# EAGLE design untitled (EAGLE 9.3.1)
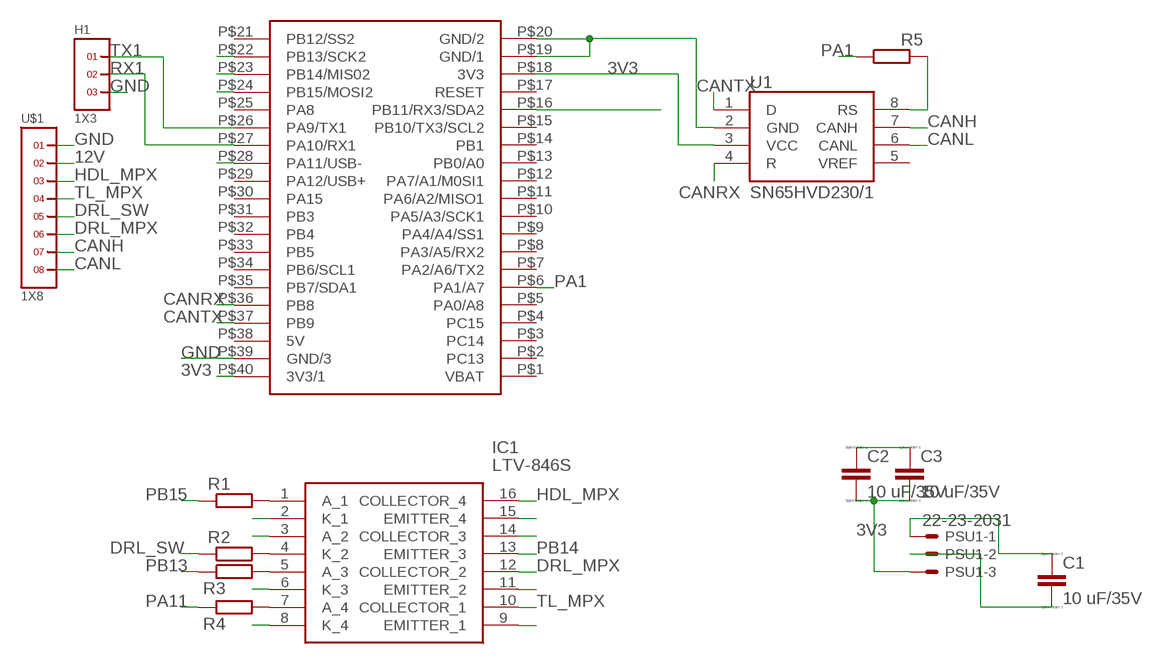
[diagram p0: schematic, sheet 1]

## Parts
C1  10 uF/35V  CC1206  [C1206]
C2  10 uF/35V  CC1206  [C1206]
C3  10 uF/35V  CC1206  [C1206]
H1  1X3  [1X3]
IC1  LTV-846S  [SOP254P1016X460-16N]
PSU1  22-23-2031  [22-23-2031]
R1  47 ohm  R-EU_R1206  [R1206]
R2  1k ohm  R-EU_R1206  [R1206]
R3  47 ohm  R-EU_R1206  [R1206]
R4  47 ohm  R-EU_R1206  [R1206]
R5  47k ohm  R-EU_R1206  [R1206]
STM32  BLUEPILL  [40-DIP-BLUE-PIL]
U1  SN65HVD230/1  [SO8]
U$1  1X8  [1X8]

## Nets
3V3: C2.2 C3.2 IC1.3(A_2) IC1.14(COLLECTOR_3) PSU1.3 STM32.P$18(3V3) STM32.P$40(3V3/1) U1.3(VCC)
12V: C1.1 PSU1.1 U$1.2
CANH: U1.7(CANH) U$1.7
CANL: U1.6(CANL) U$1.8
CANRX: STM32.P$36(PB8) U1.4(R)
CANTX: STM32.P$37(PB9) U1.1(D)
DRL_MPX: IC1.12(COLLECTOR_2) U$1.6
DRL_SW: R2.1 U$1.5
GND: C1.2 C2.1 C3.1 H1.3 IC1.2(K_1) IC1.6(K_3) IC1.8(K_4) IC1.9(EMITTER_1) IC1.11(EMITTER_2) IC1.15(EMITTER_4) PSU1.2 STM32.P$19(GND/1) STM32.P$20(GND/2) STM32.P$39(GND/3) U1.2(GND) U$1.1
HDL_MPX: IC1.16(COLLECTOR_4) U$1.3
N$2: IC1.1(A_1) R1.2
N$4: IC1.4(K_2) R2.2
N$6: IC1.5(A_3) R3.2
N$8: IC1.7(A_4) R4.2
N$9: R5.2 U1.8(RS)
PA1: R5.1 STM32.P$6(PA1/A7)
PA11: R4.1 STM32.P$28(PA11/USB-)
PB11: STM32.P$16(PB11/RX3/SDA2)
PB13: R3.1 STM32.P$22(PB13/SCK2)
PB14: IC1.13(EMITTER_3) STM32.P$23(PB14/MIS02)
PB15: R1.1 STM32.P$24(PB15/MOSI2)
RX1: H1.2 STM32.P$27(PA10/RX1)
TL_MPX: IC1.10(COLLECTOR_1) U$1.4
TX1: H1.1 STM32.P$26(PA9/TX1)
Unconnected: STM32.P$1(VBAT) STM32.P$2(PC13) STM32.P$3(PC14) STM32.P$4(PC15) STM32.P$5(PA0/A8) STM32.P$7(PA2/A6/TX2) STM32.P$8(PA3/A5/RX2) STM32.P$9(PA4/A4/SS1) STM32.P$10(PA5/A3/SCK1) STM32.P$11(PA6/A2/MISO1) STM32.P$12(PA7/A1/M0SI1) STM32.P$13(PB0/A0) STM32.P$14(PB1) STM32.P$15(PB10/TX3/SCL2) STM32.P$17(RESET) STM32.P$21(PB12/SS2) STM32.P$25(PA8) STM32.P$29(PA12/USB+) STM32.P$30(PA15) STM32.P$31(PB3) STM32.P$32(PB4) STM32.P$33(PB5) STM32.P$34(PB6/SCL1) STM32.P$35(PB7/SDA1) STM32.P$38(5V) U1.5(VREF)

## Library data of the parts
C1-C3 = eagle-ltspice:C: CAPACITOR, European symbol; SPICEMODEL: NONE; SPICEPREFIX: C
H1 = headers(.1in):1X3
IC1 = LTV-846S:LTV-846S: Optocoupler Transistor O/P, 80V, SMD16 Lite-On LTV-846S DC Input Transistor Output Quad Optocoupler, Surface Mount, 16-Pin PDIP Source: Datasheet <http://optoelectronics.liteon.com/upload/download/DS-70-97-0013/S_110_LTV-816 826 846 (M, S, S-TA, S-TA1, S-TP) Series.pdf>; ALLIED_NUMBER: R1038113; ALLIED_PRICE-STOCK: http://www.alliedelec.com/lite-on-ltv-846s/R1038113/; DESCRIPTION: Optocoupler Transistor O/P, 80V, SMD16 Lite-On LTV-846S DC Input Transistor Output Quad Optocoupler, Surface Mount, 16-Pin PDIP; HEIGHT: 4.6mm; MANUFACTURER_NAME: Lite-On; MANUFACTURER_PART_NUMBER: LTV-846S; MOUSER_PART_NUMBER: 859-LTV-846S; MOUSER_PRICE-STOCK: https://www.mouser.com/Search/Refine.aspx?Keyword=859-LTV-846S; RS_PART_NUMBER: 1689678; RS_PRICE-STOCK: http://uk.rs-online.com/web/p/products/1689678
PSU1 = con-molex:22-23-2031: .100" (2.54mm) Center Header - 3 Pin; MF: MOLEX; MPN: 22-23-2031; OC_FARNELL: 1462950; OC_NEWARK: 30C0862
R1-R5 = rcl:R-EU_: RESISTOR, European symbol; SPICEPREFIX: R
STM32 = maplemini:BLUEPILL
U1 = texas_instruments:SN65HVD230/1
U$1 = headers(2mm):1X8

## Board
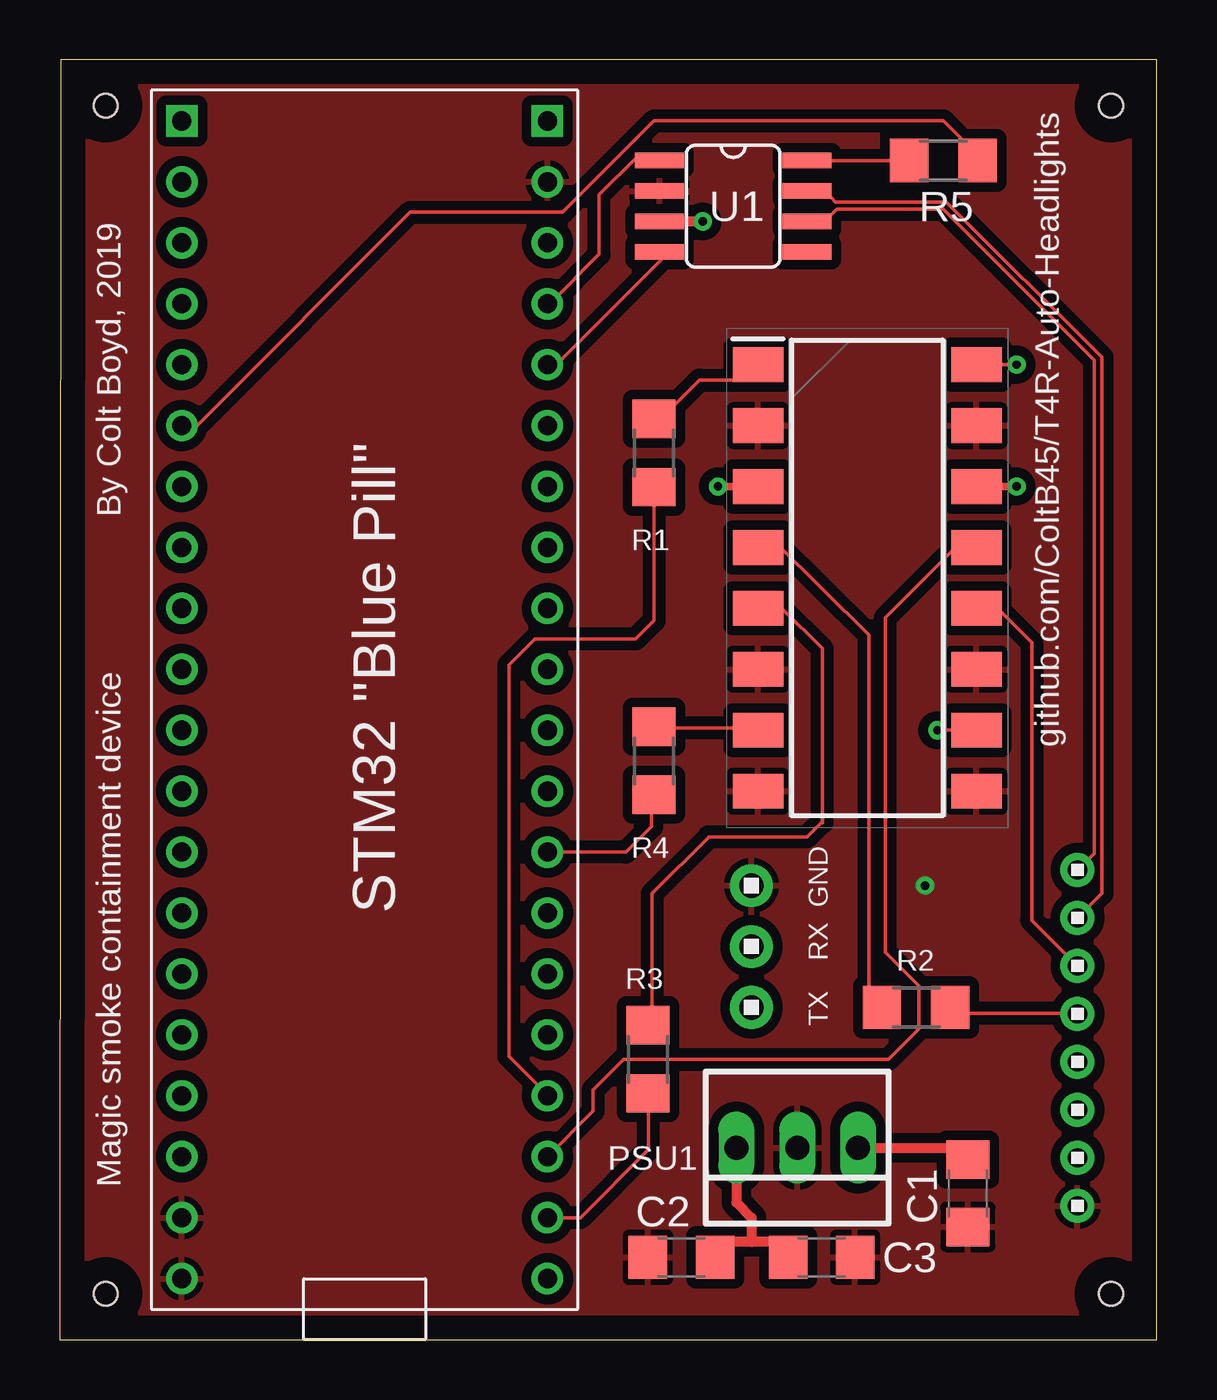
[diagram p1: board, top side]
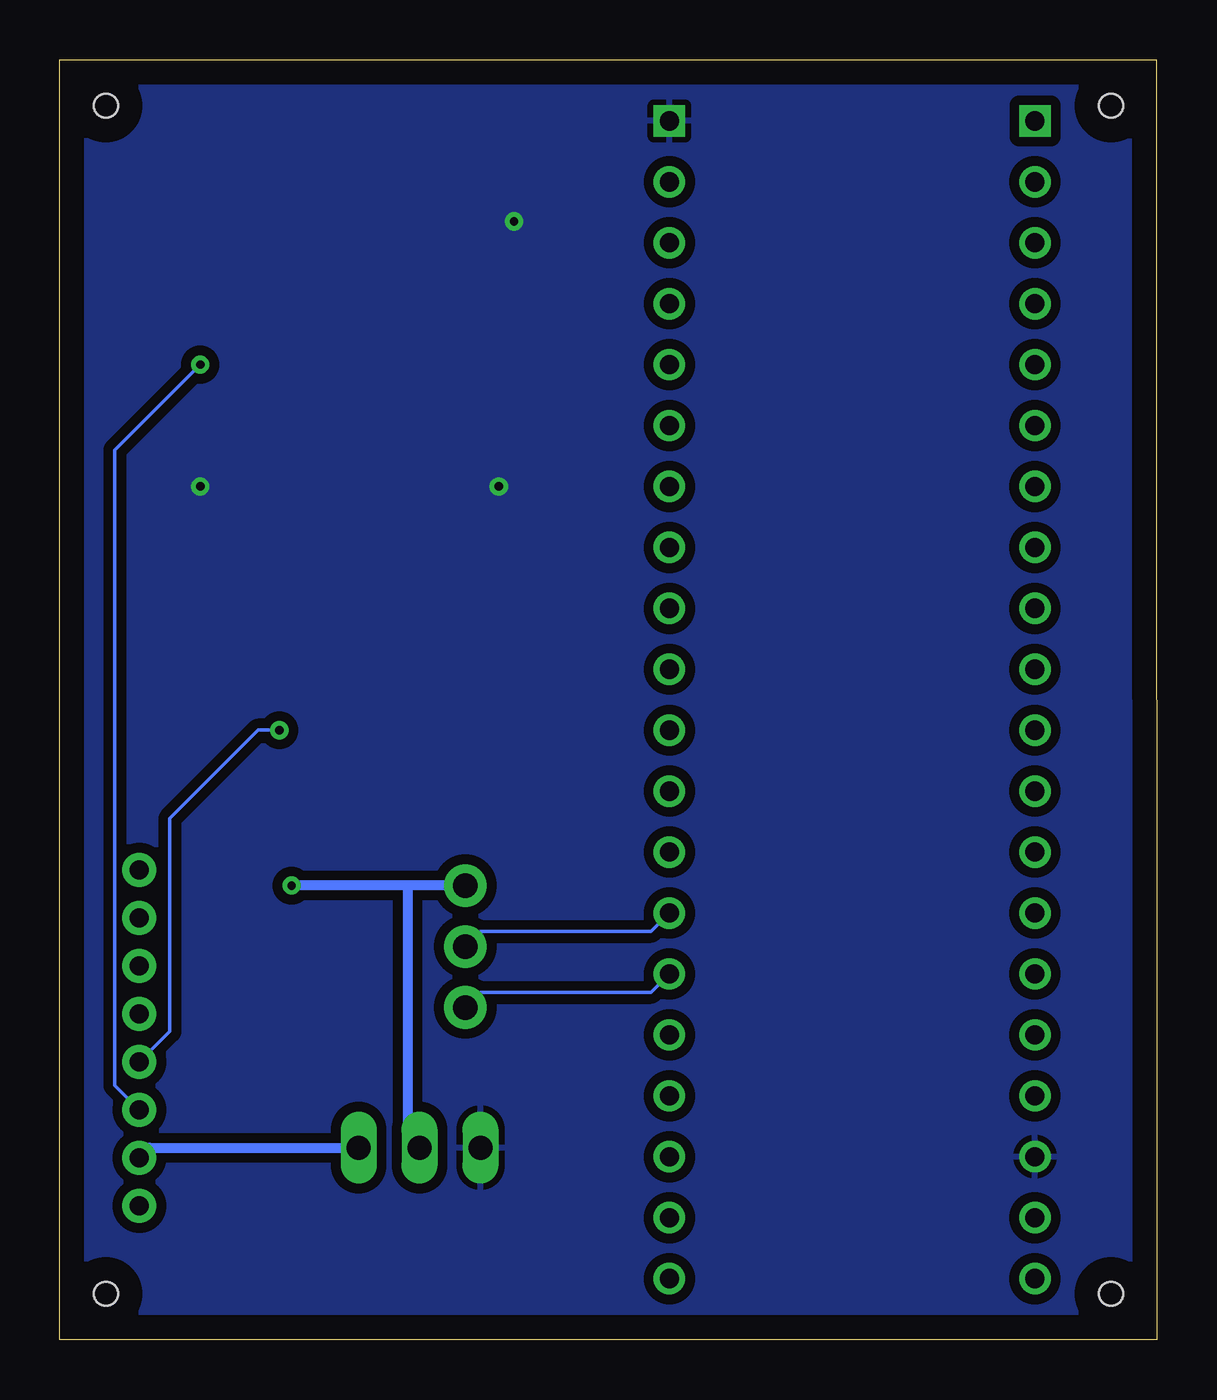
[diagram p2: board, bottom side, seen from below]

Size 45.73 x 53.34 mm. Coordinates in mm from the lower left corner, seen from the top.
Outline: 0,0 45.73,0 45.73,53.34 0.03,53.34 0,0
Copper layers (1*16): Top 0.035mm / dielectric 1.5mm / Bottom 0.035mm
Design rules "default": minimum track width 6mil, minimum drill 0.35mm, track to track 6mil, track to pad 6mil, pad to pad 6mil, via to via 6mil, smd to smd 6mil, copper to edge 40mil, drill to drill 6mil, minimum pad ring 10mil, minimum via ring 8mil, stop-mask expansion 4mil, vias tented up to drill 0mil, thermal gap 10mil
Holes 1 mm at 1.91,1.91 43.81,1.91 1.91,51.44 43.81,51.44

### Footprints (pad centres in the part's own frame; a part is rotated, then mirrored left to right if it is on the bottom)
C1206 = smd 1.6 x 1.8: 1 -1.4,0; 2 1.4,0
1X3 = drill 1.016 pad 1.778: 1 0,0; 2 2.54,0; 3 5.08,0
SOP254P1016X460-16N = smd 2.1 x 1.45: 1 -4.55,8.89; 2 -4.55,6.35; 3 -4.55,3.81; 4 -4.55,1.27; 5 -4.55,-1.27; 6 -4.55,-3.81; 7 -4.55,-6.35; 8 -4.55,-8.89; 9 4.55,-8.89; 10 4.55,-6.35; 11 4.55,-3.81; 12 4.55,-1.27; 13 4.55,1.27; 14 4.55,3.81; 15 4.55,6.35; 16 4.55,8.89
22-23-2031 = drill 1 long: 1 -2.54,0; 2 0,0; 3 2.54,0
R1206 = smd 1.6 x 1.803: 1 -1.422,0; 2 1.422,0
40-DIP-BLUE-PIL = drill 0.8 square: P$1 -7.62,22.86; P$40 7.62,22.86 | drill 0.8: P$2 -7.62,20.32; P$3 -7.62,17.78; P$4 -7.62,15.24; P$5 -7.62,12.7; P$6 -7.62,10.16; P$7 -7.62,7.62; P$8 -7.62,5.08; P$9 -7.62,2.54; P$10 -7.62,0; P$11 -7.62,-2.54; P$12 -7.62,-5.08; P$13 -7.62,-7.62; P$14 -7.62,-10.16; P$15 -7.62,-12.7; P$16 -7.62,-15.24; P$17 -7.62,-17.78; P$18 -7.62,-20.32; P$19 -7.62,-22.86; P$20 -7.62,-25.4; P$21 7.62,-25.4; P$22 7.62,-22.86; P$23 7.62,-20.32; P$24 7.62,-17.78; P$25 7.62,-15.24; P$26 7.62,-12.7; P$27 7.62,-10.16; P$28 7.62,-7.62; P$29 7.62,-5.08; P$30 7.62,-2.54; P$31 7.62,0; P$32 7.62,2.54; P$33 7.62,5.08; P$34 7.62,7.62; P$35 7.62,10.16; P$36 7.62,12.7; P$37 7.62,15.24; P$38 7.62,17.78; P$39 7.62,20.32
SO8 = smd 0.66 x 2.032: 1 -1.905,-3.073; 2 -0.635,-3.073; 3 0.635,-3.073; 4 1.905,-3.073; 5 1.905,3.073; 6 0.635,3.073; 7 -0.635,3.073; 8 -1.905,3.073
1X8 = drill 0.8 pad 1.422: 1 -7,0; 2 -5,0; 3 -3,0; 4 -1,0; 5 1,0; 6 3,0; 7 5,0; 8 7,0

### Placement (x,y rotation side)
C1  37.85,6.1 270 top
C2  25.91,3.43 0 top
C3  31.75,3.43 180 top
H1  28.83,13.84 90 top
IC1  33.66,31.75 0 top
PSU1  30.73,8 180 top
R1  24.77,36.96 90 top
R2  35.69,13.84 180 top
R3  24.51,11.68 90 top
R4  24.77,24.13 90 top
R5  36.83,49.15 180 top
STM32  12.7,27.94 0 top
U1  28.07,47.24 270 top
U$1  42.42,12.57 90 top

### Tracks (layer width: path | path; a pad name or v marks a point on that pad's centre or on a via)
3V3  (via drill 0.35)
  Top 0.305: v27.43,35.56 IC1.3 | v39.88,35.56 IC1.14
  Top 0.406: PSU1.3 28.19,5.72 28.83,5.08 28.83,4.06 | 28.83,4.06 27.94,4.06 C2.2 | C3.2 29.71,4.06 28.83,4.06 | v26.8,46.61 U1.3
  pour Bottom (isolate 0.406): 0.13,53.21 45.59,53.21 45.59,0.13 0.13,0.13
12V
  Top 0.406: PSU1.1 37.34,8 C1.1
  Bottom 0.406: U$1.2 41.99,8 PSU1.1
CANH
  Top 0.152: U1.7 31.39,47.62 32.13,47.62 32.33,47.42 36.96,47.42 43.43,40.94 43.43,18.59 U$1.7
CANL
  Top 0.152: U1.6 31.88,46.61 32.38,47.12 36.83,47.12 43.13,40.82 43.13,20.27 43.05,20.19 U$1.8
CANRX
  Top 0.152: U1.4 25.2,45.14 20.7,40.64 STM32.P$36
CANTX
  Top 0.152: STM32.P$37 20.42,43.18 22.48,45.24 22.48,47.73 24.07,49.31 24.23,49.15 U1.1
DRL_MPX
  Top 0.152: IC1.12 39.09,30.48 40.51,29.06 40.51,17.48 U$1.6
DRL_SW
  Top 0.152: U$1.5 42.4,13.59 37.36,13.59 R2.1
GND  (via drill 0.35)
  Bottom 0.406: H1.3 31.24,18.92 | 31.24,18.92 v36.07,18.92 | 31.24,18.92 31.24,8.51 PSU1.2
  pour Top (isolate 0.406): 0.13,53.21 0.13,0.13 45.59,0.13 45.59,53.21
HDL_MPX  (via drill 0.35)
  Top 0.152: IC1.16 v39.88,40.64
  Bottom 0.152: v39.88,40.64 43.43,37.08 43.43,10.59 U$1.3
N$2
  Top 0.152: R1.2 25.38,38.99 25.65,38.99 26.67,40.01 28.47,40.01 IC1.1
N$4
  Top 0.152: IC1.4 29.83,33.23 33.73,29.36 33.73,14.02 33.91,13.84 R2.2
N$6
  Top 0.152: R3.2 24.69,13.29 24.69,18.59 27.05,20.96 31.14,20.96 31.77,21.59 | IC1.5 30.1,30.48 31.77,28.8 31.77,21.59 | 31.77,21.54 31.77,21.59
N$8
  Top 0.152: R4.2 24.82,25.5 29.08,25.5 IC1.7
N$9
  Top 0.152: R5.2 U1.8
PA1
  Top 0.152: STM32.P$6 5.71,38.1 14.61,46.99 20.95,46.99 24.77,50.8 36.83,50.8 38.25,49.38 R5.1
PA11
  Top 0.152: R4.1 24.66,22.61 24.66,21.39 23.6,20.32 STM32.P$28
PB13
  Top 0.152: R3.1 24.54,10.26 24.54,7.92 21.69,5.08 STM32.P$22
PB14
  Top 0.152: STM32.P$23 22.23,9.52 22.23,10.41 23.5,11.68 34.54,11.68 35.81,12.95 35.81,14.73 34.42,16.13 34.42,30.1 37.34,33.02 IC1.13
PB15
  Top 0.152: 24.66,35.54 R1.1 24.77,29.97 24,29.21 19.81,29.21 18.72,28.12 18.72,11.81 20.27,10.26 STM32.P$24
RX1
  Bottom 0.152: H1.2 28.19,17.02 21.08,17.02 STM32.P$27
TL_MPX  (via drill 0.35)
  Top 0.152: IC1.10 v36.58,25.4
  Bottom 0.152: v36.58,25.4 37.47,25.4 41.15,21.72 41.15,12.84 U$1.4
TX1
  Bottom 0.152: H1.1 28.19,14.48 21.08,14.48 STM32.P$26

### Text on the board
tNames: github.com/ColtB45/T4R-Auto-Headlights | By Colt Boyd, 2019 | STM32 "Blue Pill" | TX RX GND | Magic smoke containment device